# EAGLE design identity-disk-clock (EAGLE 6.3)
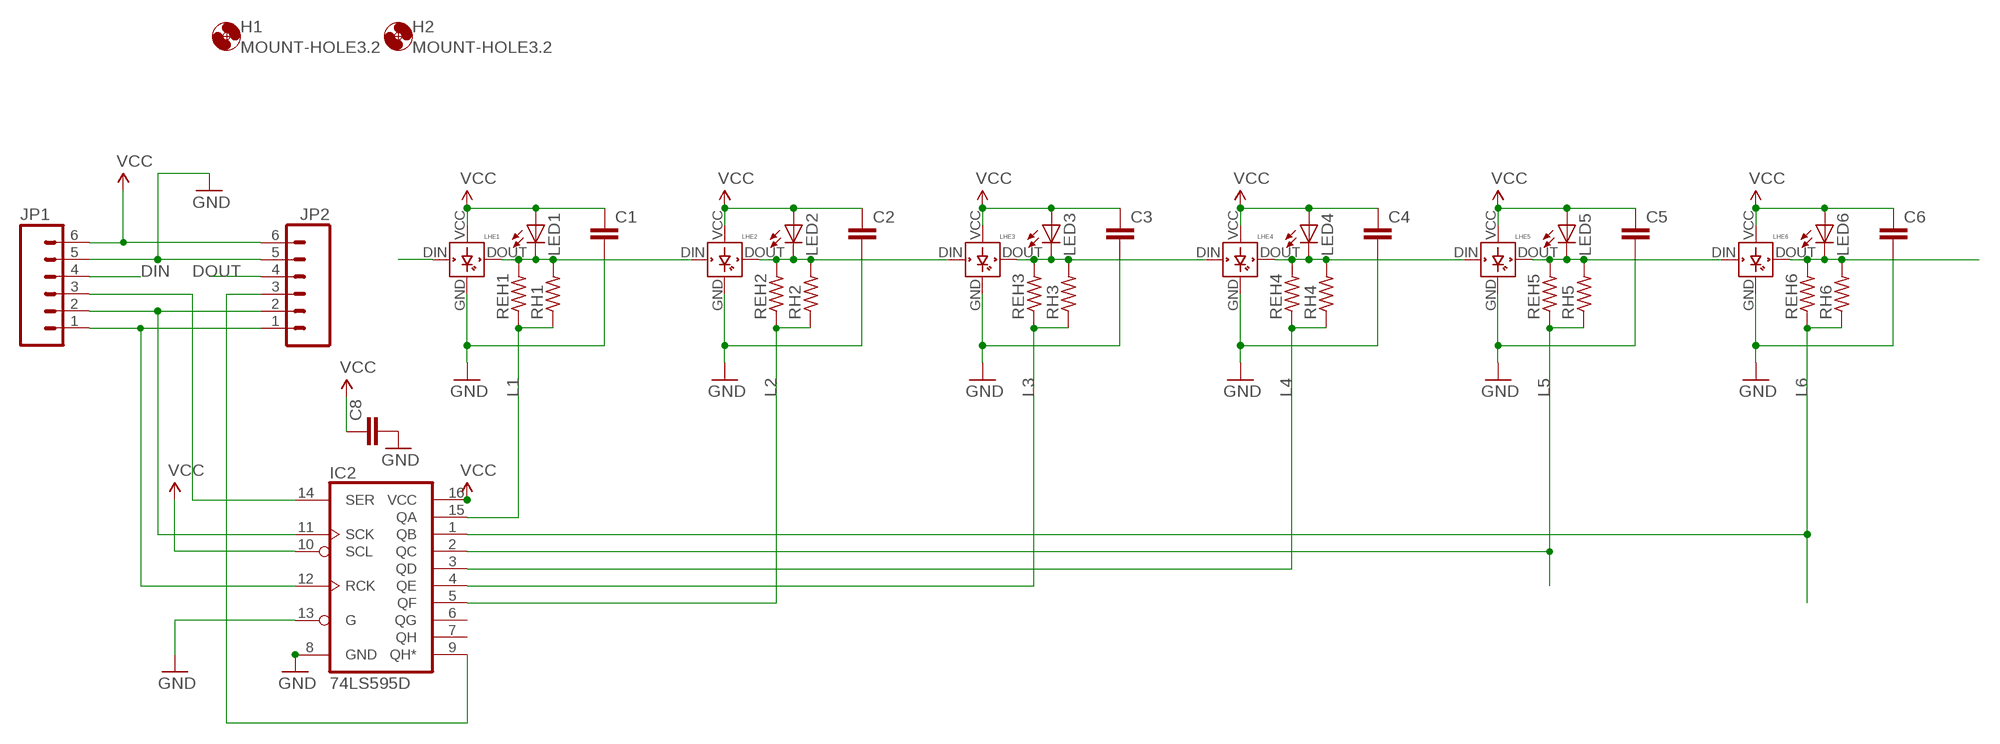
[diagram p0: schematic, sheet 1]

## Parts
C1  C-EU050-024X044  [C050-024X044]
C2  C-EU050-024X044  [C050-024X044]
C3  C-EU050-024X044  [C050-024X044]
C4  C-EU050-024X044  [C050-024X044]
C5  C-EU050-024X044  [C050-024X044]
C6  C-EU050-024X044  [C050-024X044]
C8  C-EUC0402  [C0402]
H1  MOUNT-HOLE3.2  [3,2]
H2  MOUNT-HOLE3.2  [3,2]
IC2  74LS595D  [SO16]
JP1  M06LOCK  [1X06_LOCK]
JP2  M06LOCK  [1X06_LOCK]
LED1  LEDMICRO-SIDELED  [MICRO-SIDELED]
LED2  LEDMICRO-SIDELED  [MICRO-SIDELED]
LED3  LEDMICRO-SIDELED  [MICRO-SIDELED]
LED4  LEDMICRO-SIDELED  [MICRO-SIDELED]
LED5  LEDMICRO-SIDELED  [MICRO-SIDELED]
LED6  LEDMICRO-SIDELED  [MICRO-SIDELED]
LHE1  WS2812B  [LED5MMRGBNP]
LHE2  WS2812B  [LED5MMRGBNP]
LHE3  WS2812B  [LED5MMRGBNP]
LHE4  WS2812B  [LED5MMRGBNP]
LHE5  WS2812B  [LED5MMRGBNP]
LHE6  WS2812B  [LED5MMRGBNP]
REH1  R-US_R0402  [R0402]
REH2  R-US_R0402  [R0402]
REH3  R-US_R0402  [R0402]
REH4  R-US_R0402  [R0402]
REH5  R-US_R0402  [R0402]
REH6  R-US_R0402  [R0402]
RH1  R-US_0204/5  [0204/5]
RH2  R-US_0204/5  [0204/5]
RH3  R-US_0204/5  [0204/5]
RH4  R-US_0204/5  [0204/5]
RH5  R-US_0204/5  [0204/5]
RH6  R-US_0204/5  [0204/5]

## Nets
DIN: JP1.4 LHE1.DIN
DOUT: JP2.4 LED6.C LHE6.DOUT REH6.2 RH6.2
GND: C1.2 C2.2 C3.2 C4.2 C5.2 C6.2 C8.2 IC2.8(GND) IC2.13(G) JP1.5 JP2.5 LHE1.GND LHE2.GND LHE3.GND LHE4.GND LHE5.GND LHE6.GND
L1: IC2.15(QA) REH1.1 RH1.1
L2: IC2.5(QF) REH2.1 RH2.1
L3: IC2.4(QE) REH3.1 RH3.1
L4: IC2.3(QD) REH4.1 RH4.1
L5: IC2.2(QC) REH5.1 RH5.1
L6: IC2.1(QB) REH6.1 RH6.1
N$1: LED1.C LHE1.DOUT LHE2.DIN REH1.2 RH1.2
N$2: LED2.C LHE2.DOUT LHE3.DIN REH2.2 RH2.2
N$3: LED3.C LHE3.DOUT LHE4.DIN REH3.2 RH3.2
N$4: LED4.C LHE4.DOUT LHE5.DIN REH4.2 RH4.2
N$5: LED5.C LHE5.DOUT LHE6.DIN REH5.2 RH5.2
N$15: IC2.11(SCK) JP1.2 JP2.2
N$16: IC2.12(RCK) JP1.1 JP2.1
N$18: IC2.14(SER) JP1.3
N$20: IC2.9(QH*) JP2.3
VCC: C1.1 C2.1 C3.1 C4.1 C5.1 C6.1 C8.1 IC2.10(SCL) IC2.16(VCC) JP1.6 JP2.6 LED1.A LED2.A LED3.A LED4.A LED5.A LED6.A LHE1.VCC(VDD) LHE2.VCC(VDD) LHE3.VCC(VDD) LHE4.VCC(VDD) LHE5.VCC(VDD) LHE6.VCC(VDD)
Unconnected: IC2.6(QG) IC2.7(QH)

## Library data of the parts
C1-C6 = rcl:C-EU: CAPACITOR, European symbol
C8 = resistor:C-EU: CAPACITOR, European symbol
H1 H2 = holes:MOUNT-HOLE: MOUNTING HOLE with drill center marker
IC2 = SparkFun-DigitalIC:74*595: 8-bit SHIFT REGISTER, output latch
JP1 JP2 = SparkFun-Connectors:M06: Header 6 Standard 6-pin 0.1" header. Use with straight break away headers (SKU : PRT-00116), right angle break away headers (PRT-00553), swiss pins (PRT-00743), machine pins (PRT-00117), and female headers (PRT-00115). Molex polarized connector foot print use with SKU : PRT-08094 with associated crimp pins and housings. NOTES ON THE VARIANTS LOCK and LOCK_LONGPADS... This footprint was designed to help hold the alignment of a through-hole component (i.e. 6-pin header) while soldering it into place. You may notice that each hole has been shifted either up or down by 0.005 of an inch from it's more standard position (which is a perfectly straight line). This slight alteration caused the pins (the squares in the middle) to touch the edges of the holes. Because they are alternating, it causes a "brace" to hold the component in place. 0.005 has proven to be the perfect amount of "off-center" position when using our standard breakaway headers. Although looks a little odd when you look at the bare footprint, once you have a header in there, the alteration is very hard to notice. Also,if you push a header all the way into place, it is covered up entirely on the bottom side. This idea of altering the position of holes to aid alignment will be further integrated into the Sparkfun Library for other footprints. It can help hold any component with 3 or more connection pins.
LED1-LED6 = led:LED: LED OSRAM: - CHIPLED LG R971, LG N971, LY N971, LG Q971, LY Q971, LO R971, LY R971 LH N974, LH R974 LS Q976, LO Q976, LY Q976 LO Q996 - Hyper CHIPLED LW Q18S LB Q993, LB Q99A, LB R99A - SideLED LS A670, LO A670, LY A670, LG A670, LP A670 LB A673, LV A673, LT A673, LW A673 LH A674 LY A675 LS A676, LA A676, LO A676, LY A676, LW A676 LS A679, LY A679, LG A679 - Hyper Micro SIDELED® LS Y876, LA Y876, LO Y876, LY Y876 LT Y87S - SmartLED LW L88C, LW L88S LB L89C, LB L89S, LG L890 LS L89K, LO L89K, LY L89K LS L896, LA L896, LO L896, LY L896 - TOPLED LS T670, LO T670, LY T670, LG T670, LP T670 LSG T670, LSP T670, LSY T670, LOP T670, LYG T670 LG T671, LOG T671, LSG T671 LB T673, LV T673, LT T673, LW T673 LH T674 LS T676, LA T676, LO T676, LY T676, LB T676, LH T676, LSB T676, LW T676 LB T67C, LV T67C, LT T67C, LS T67K, LO T67K, LY T67K, LW E67C LS E67B, LA E67B, LO E67B, LY E67B, LB E67C, LV E67C, LT E67C LW T67C LS T679, LY T679, LG T679 LS T770, LO T770, LY T770, LG T770, LP T770 LB T773, LV T773, LT T773, LW T773 LH T774 LS E675, LA E675, LY E675, LS T675 LS T776, LA T776, LO T776, LY T776, LB T776 LHGB T686 LT T68C, LB T68C - Hyper Mini TOPLED® LB M676 - Mini TOPLED Santana® LG M470 LS M47K, LO M47K, LY M47K Source: http://www.osram.convergy.de LUXEON: - LUMILED® LXK2-PW12-R00, LXK2-PW12-S00, LXK2-PW14-U00, LXK2-PW14-V00 LXK2-PM12-R00, LXK2-PM12-S00, LXK2-PM14-U00 LXK2-PE12-Q00, LXK2-PE12-R00, LXK2-PE12-S00, LXK2-PE14-T00, LXK2-PE14-U00 LXK2-PB12-K00, LXK2-PB12-L00, LXK2-PB12-M00, LXK2-PB14-N00, LXK2-PB14-P00, LXK2-PB14-Q00 LXK2-PR12-L00, LXK2-PR12-M00, LXK2-PR14-Q00, LXK2-PR14-R00 LXK2-PD12-Q00, LXK2-PD12-R00, LXK2-PD12-S00 LXK2-PH12-R00, LXK2-PH12-S00 LXK2-PL12-P00, LXK2-PL12-Q00, LXK2-PL12-R00 Source: www.luxeon.com KINGBRIGHT: KA-3528ASYC Source: www.kingbright.com
LHE1-LHE6 = adafruit:WS2812B
REH1-REH6 RH1-RH6 = adafruit:R-US_: RESISTOR, American symbol

## Board
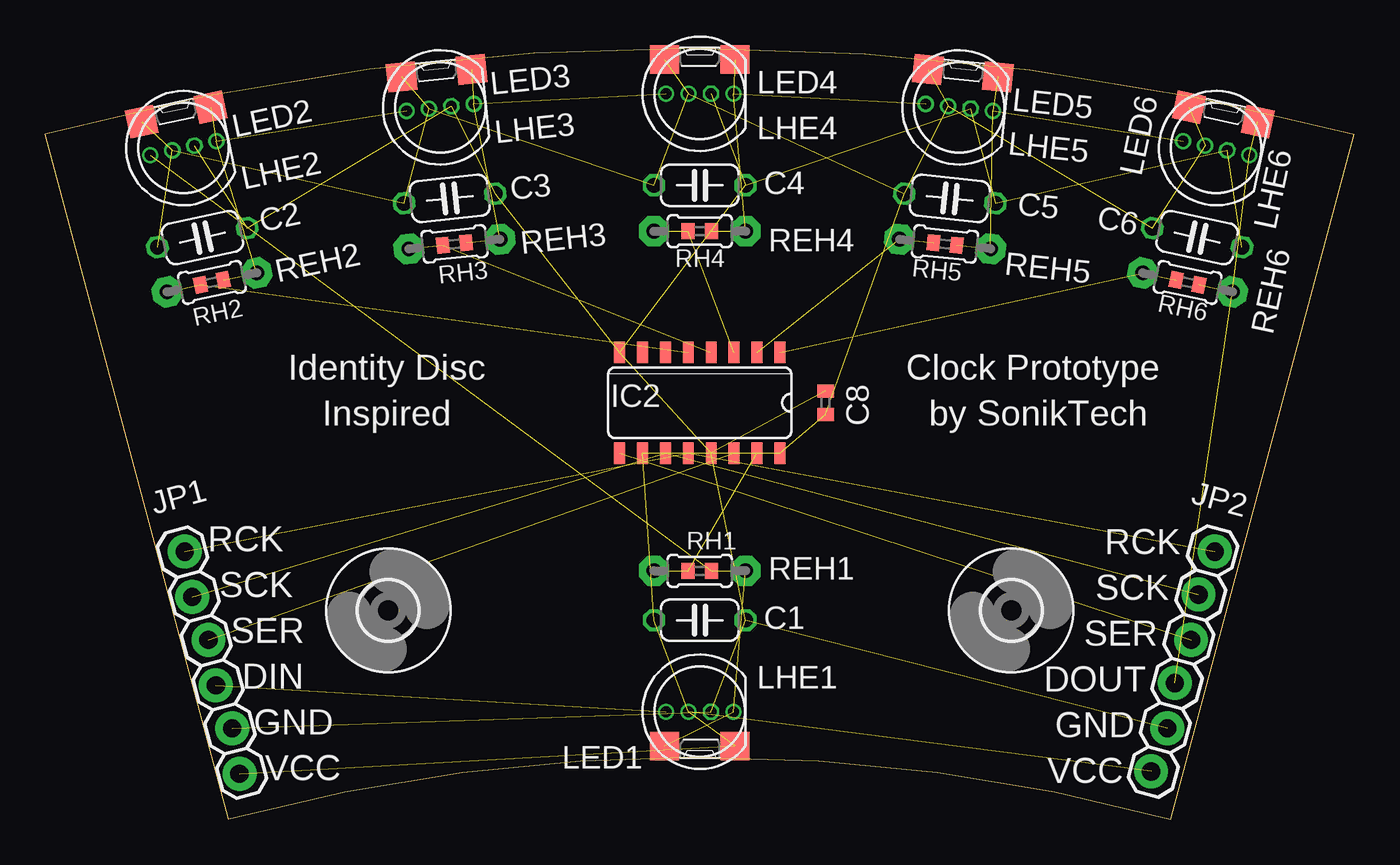
[diagram p1: board, top side]
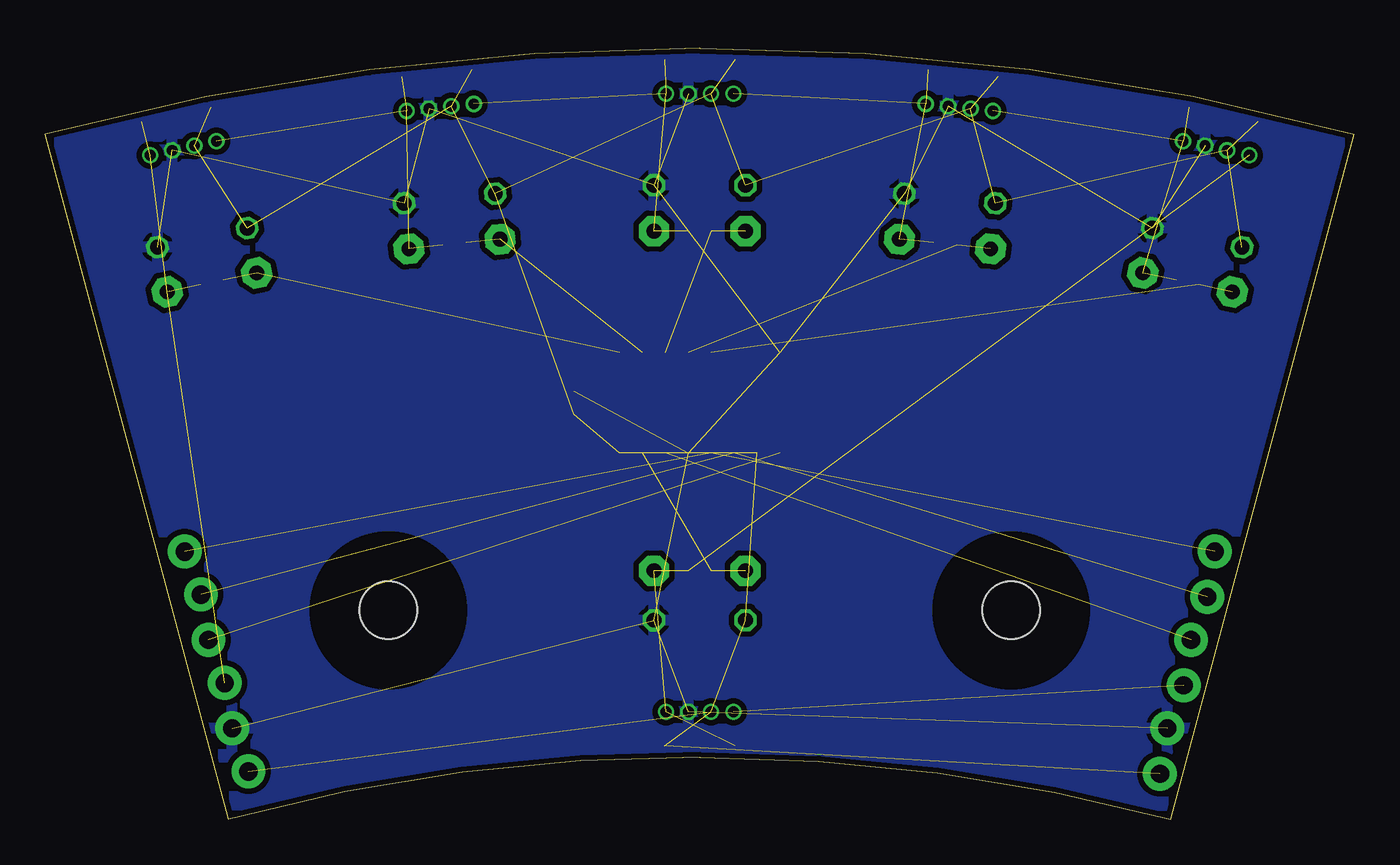
[diagram p2: board, bottom side, seen from below]

Size 72.64 x 42.81 mm. Coordinates in mm from the lower left corner, seen from the top.
Outline: 62.45,0 72.64,38.03 arc15 36.32,42.81 arc15 0,38.03 10.19,0 arc-15 36.32,3.44 arc-16 62.45,0
Copper layers (1*16): Top 0.035mm / dielectric 1.5mm / Bottom 0.035mm
Design rules "ElecFreaks_CAM_DRC_V1.0 *": minimum track width 6mil, minimum drill 15mil, track to track 6mil, track to pad 6mil, pad to pad 6mil, via to via 6mil, smd to smd 0mil, copper to edge 10mil, drill to drill 10mil, minimum pad ring 5mil, minimum via ring 5mil, stop-mask expansion 2mil, vias tented up to drill 100mil, thermal gap 10mil

### Footprints (pad centres in the part's own frame; a part is rotated, then mirrored left to right if it is on the bottom)
C050-024X044 = drill 0.813 octagon: 1 -2.54,0; 2 2.54,0
C0402 = smd 0.7 x 0.9: 1 -0.65,0; 2 0.65,0
3,2 = hole 3.2: 0,0
SO16 = smd 0.6 x 1.2: 1 -4.445,-2.8; 2 -3.175,-2.8; 3 -1.905,-2.8; 4 -0.635,-2.8; 5 0.635,-2.8; 6 1.905,-2.8; 7 3.175,-2.8; 8 4.445,-2.8; 9 4.445,2.8; 10 3.175,2.8; 11 1.905,2.8; 12 0.635,2.8; 13 -0.635,2.8; 14 -1.905,2.8; 15 -3.175,2.8; 16 -4.445,2.8
1X06_LOCK = drill 1.016 pad 1.88: 1 0,0; 2 2.54,-0.254; 3 5.08,0; 4 7.62,-0.254; 5 10.16,0; 6 12.7,-0.254
MICRO-SIDELED = smd 1.6 x 1.6: A 0,1.95; C 0,-1.95
LED5MMRGBNP = drill 0.6 pad 0.838: DIN 1.875,0; DOUT -1.875,0; VCC 0.625,0 | drill 0.6 pad 0.838 octagon: GND -0.625,0
R0402 = smd 0.7 x 0.9: 1 -0.65,0; 2 0.65,0
0204/5 = drill 0.813 pad 1.676 octagon: 1 -2.54,0; 2 2.54,0

### Placement (x,y rotation side)
C1  36.32,11.06 0 top
C2  8.73,32.29 12 top
C3  22.45,34.46 6 top
C4  36.32,35.19 0 top
C5  50.19,34.46 354 top
C6  63.91,32.29 348 top
C8  43.31,23.13 90 top
H1  19.04,11.6 0 top
H2  53.61,11.6 0 top
IC2  36.32,23.13 180 top
JP1  7.75,14.87 285 top
JP2  64.9,14.87 255 top
LED1  36.32,4.08 270 top
LED2  7.28,39.12 102 top
LED3  21.72,41.41 96 top
LED4  36.32,42.18 90 top
LED5  50.92,41.41 84 top
LED6  65.37,39.12 78 top
LHE1  36.32,5.98 180 top
LHE2  7.67,37.26 192 top
LHE3  21.92,39.52 186 top
LHE4  36.32,40.27 180 top
LHE5  50.72,39.52 174 top
LHE6  64.97,37.26 168 top
REH1  36.32,13.8 0 top
REH2  9.26,29.81 12 top
REH3  22.71,31.94 6 top
REH4  36.32,32.65 0 top
REH5  49.93,31.94 354 top
REH6  63.39,29.81 348 top
RH1  36.32,13.8 0 top
RH2  9.26,29.81 12 top
RH3  22.71,31.94 6 top
RH4  36.32,32.65 0 top
RH5  49.93,31.94 354 top
RH6  63.39,29.81 348 top

### Tracks (layer width: path | path; a pad name or v marks a point on that pad's centre or on a via)
DIN  (1 unrouted)
DOUT  (4 unrouted)
GND  (16 unrouted)
  pour Bottom (isolate 0.305): 0.13,38.37 10.29,-1 36.32,2.81 62.36,-1 72.52,38.37 54.1,42.18 35.69,43.45 19.81,42.81 0.76,38.37
L1  (2 unrouted)
L2  (2 unrouted)
L3  (2 unrouted)
L4  (2 unrouted)
L5  (2 unrouted)
L6  (2 unrouted)
N$1  (4 unrouted)
N$2  (4 unrouted)
N$3  (4 unrouted)
N$4  (4 unrouted)
N$5  (4 unrouted)
N$15  (2 unrouted)
N$16  (2 unrouted)
N$18  (1 unrouted)
N$20  (1 unrouted)
VCC  (22 unrouted)

### Text on the board
tNames: Identity Disc | Clock Prototype | Inspired | by SonikTech | RCK | RCK | SCK | SCK | SER | SER | DOUT | DIN | GND | GND | VCC | VCC